# EAGLE design JOY_1_0 (EAGLE 8.3.2)
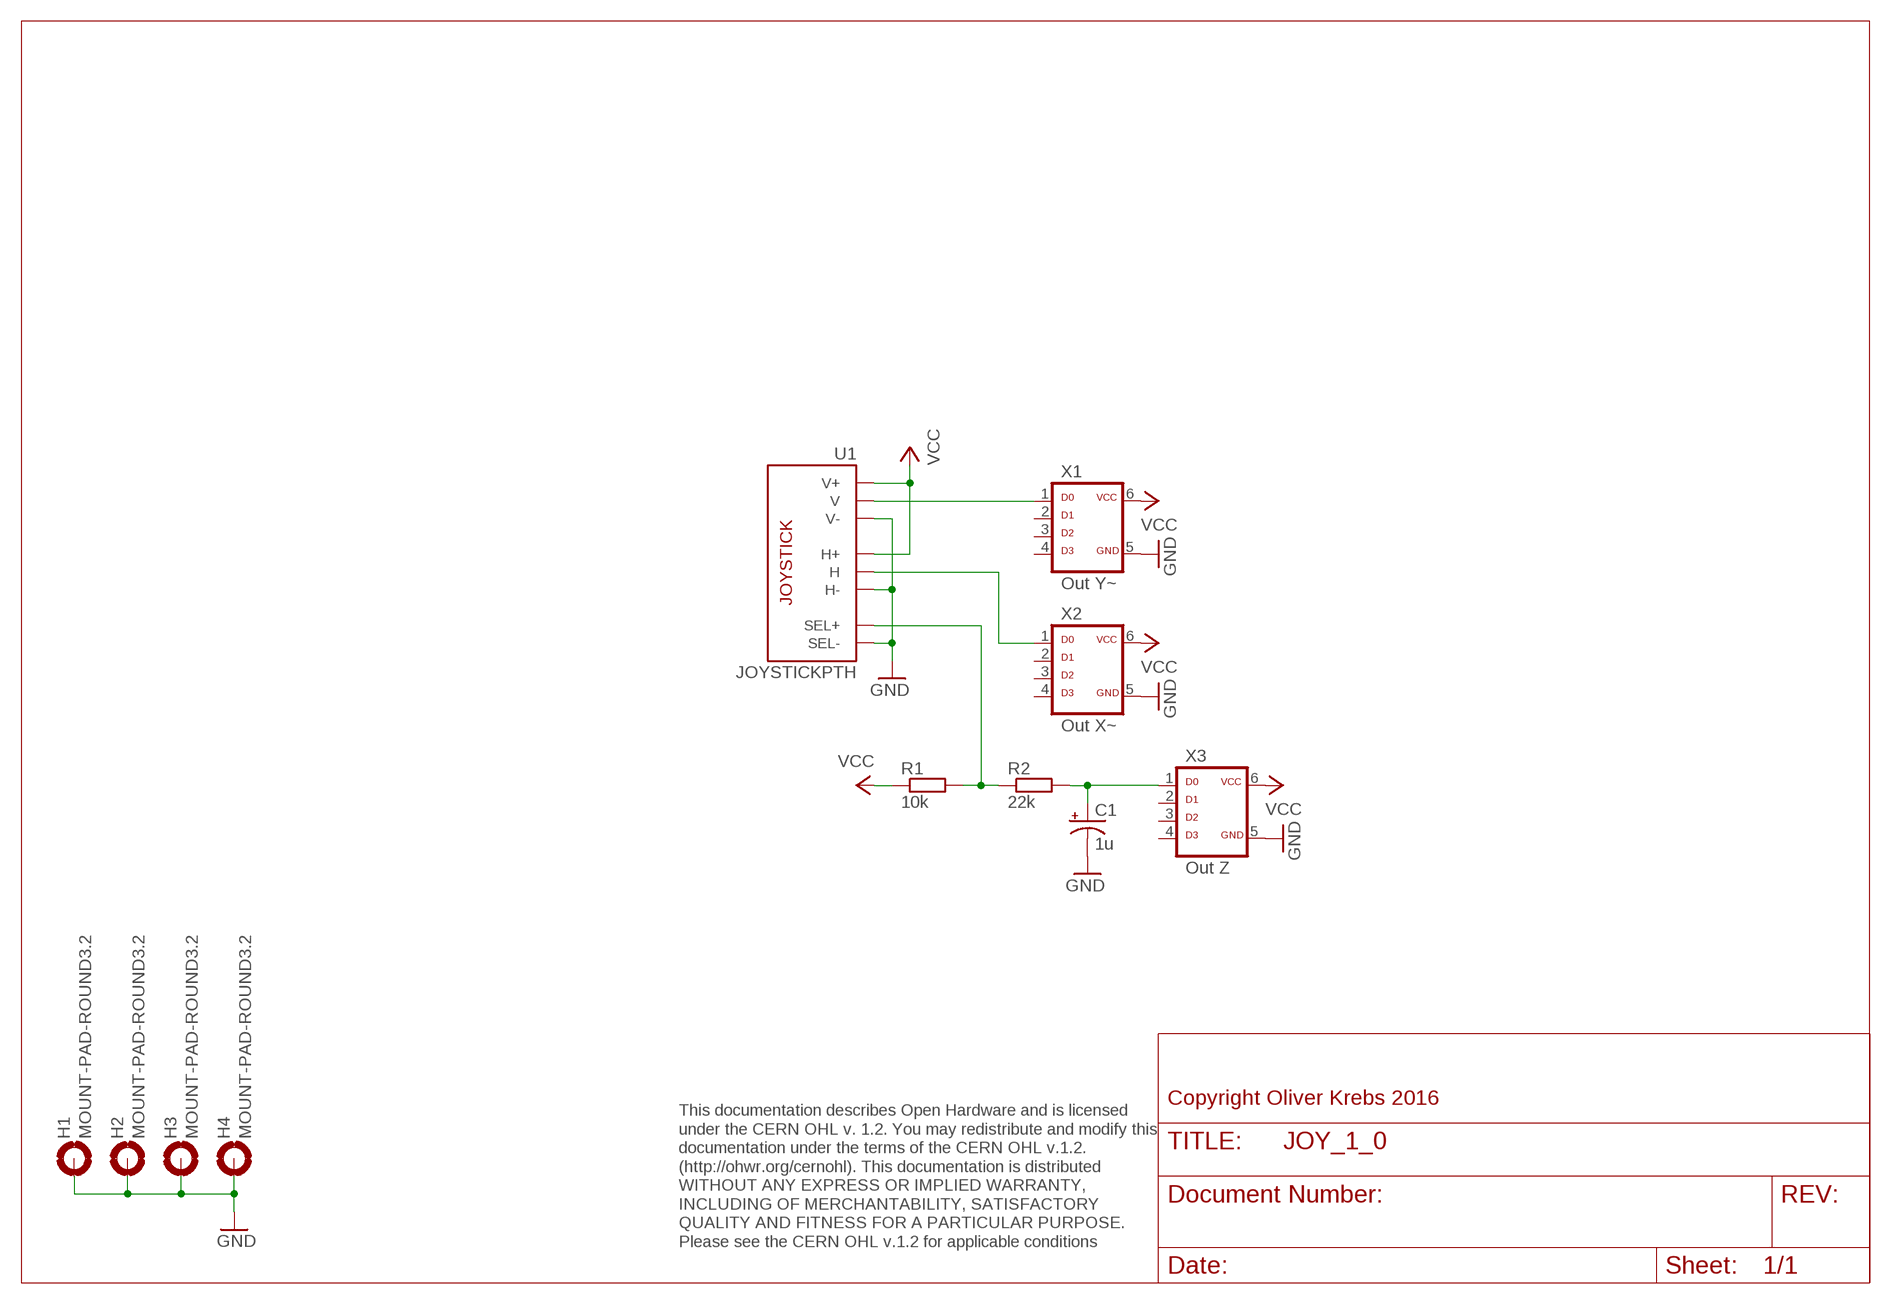
[diagram p0: schematic, sheet 1]

## Parts
C1  1u  CAP_POLPTH2  [CPOL-RADIAL-10UF-25V]
H1  MOUNT-PAD-ROUND3.2  [3,2-PAD]
H2  MOUNT-PAD-ROUND3.2  [3,2-PAD]
H3  MOUNT-PAD-ROUND3.2  [3,2-PAD]
H4  MOUNT-PAD-ROUND3.2  [3,2-PAD]
R1  10k  R-EU_0207/10  [0207/10]
R2  22k  R-EU_0207/10  [0207/10]
U1  JOYSTICKPTH  [JOYSTICK]
X1  Out Y~  ML6D  [ML-6]
X2  Out X~  ML6D  [ML-6]
X3  Out Z  ML6D  [ML-6]

## Nets
GND: C1.2(-) H1.B3,2(MOUNT) H2.B3,2(MOUNT) H3.B3,2(MOUNT) H4.B3,2(MOUNT) U1.B2A(SEL-) U1.H3(H-) U1.V3(V-) X1.5 X2.5 X3.5
N$1: U1.V2(V) X1.1
N$2: U1.H2(H) X2.1
N$3: R1.2 R2.1 U1.B1A(SEL+)
N$4: C1.1(+) R2.2 X3.1
VCC: R1.1 U1.H1(H+) U1.V1(V+) X1.6 X2.6 X3.6
Unconnected: X1.2 X1.3 X1.4 X2.2 X2.3 X2.4 X3.2 X3.3 X3.4

## Notes on the sheet
- Copyright Oliver Krebs 2016
- This documentation describes Open Hardware and is licensed 
  under the CERN OHL v. 1.2. You may redistribute and modify this 
  documentation under the terms of the CERN OHL v.1.2. 
  (http://ohwr.org/cernohl). This documentation is distributed
  WITHOUT ANY EXPRESS OR IMPLIED WARRANTY, 
  INCLUDING OF MERCHANTABILITY, SATISFACTORY 
  QUALITY AND FITNESS FOR A PARTICULAR PURPOSE. 
  Please see the CERN OHL v.1.2 for applicable conditions

## Library data of the parts
C1 = SparkFun-Passives:CAP_POL: Capacitor Polarized These are standard SMD and PTH capacitors. Normally 10uF, 47uF, and 100uF in electrolytic and tantalum varieties. Always verify the external diameter of the through hole cap, it varies with capacity, voltage, and manufacturer. The EIA devices should be standard.
H1-H4 = holes:MOUNT-PAD-ROUND: MOUNTING PAD, round
R1 R2 = 01-my_rcl:R-EU_: RESISTOR, European symbol
U1 = SparkFun-Electromechanical:JOYSTICK: Thumb Joystick Joystick commonly found in PS2 controllers. Two pots and a select switch. Footprint proven. Spark Fun Electronics SKU : COM-09032
X1-X3 = 01-my-con:ML6D

## Board
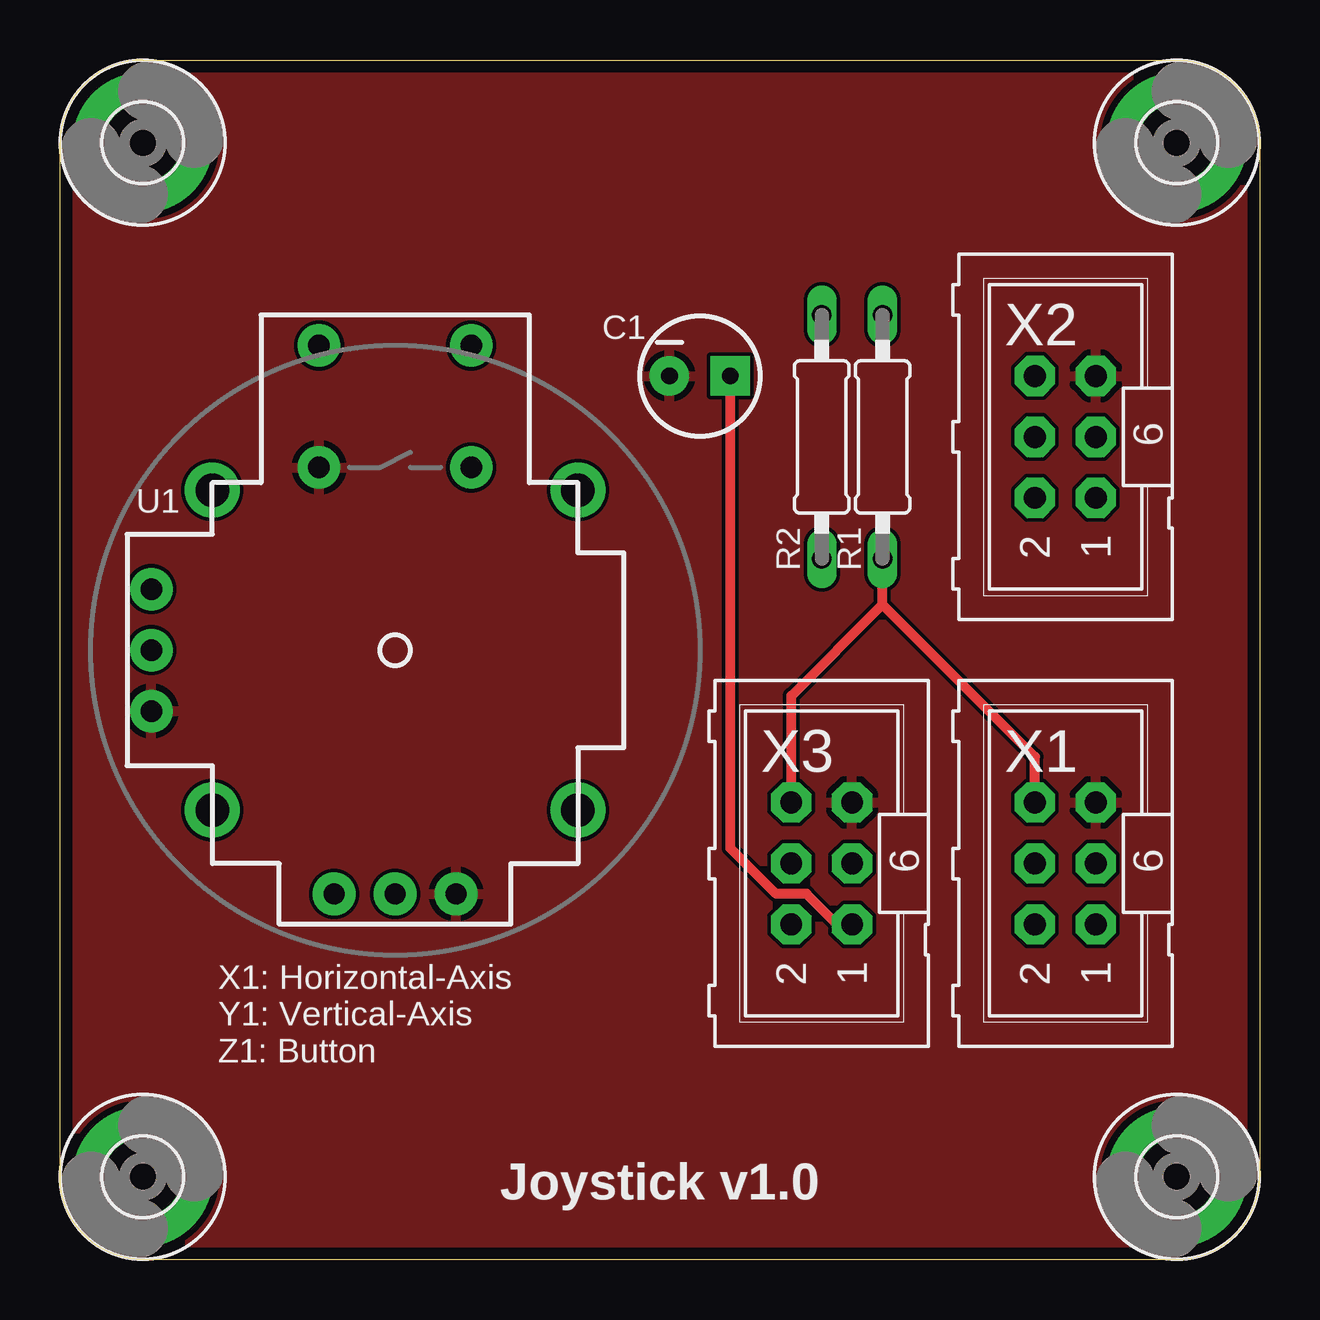
[diagram p1: board, top side]
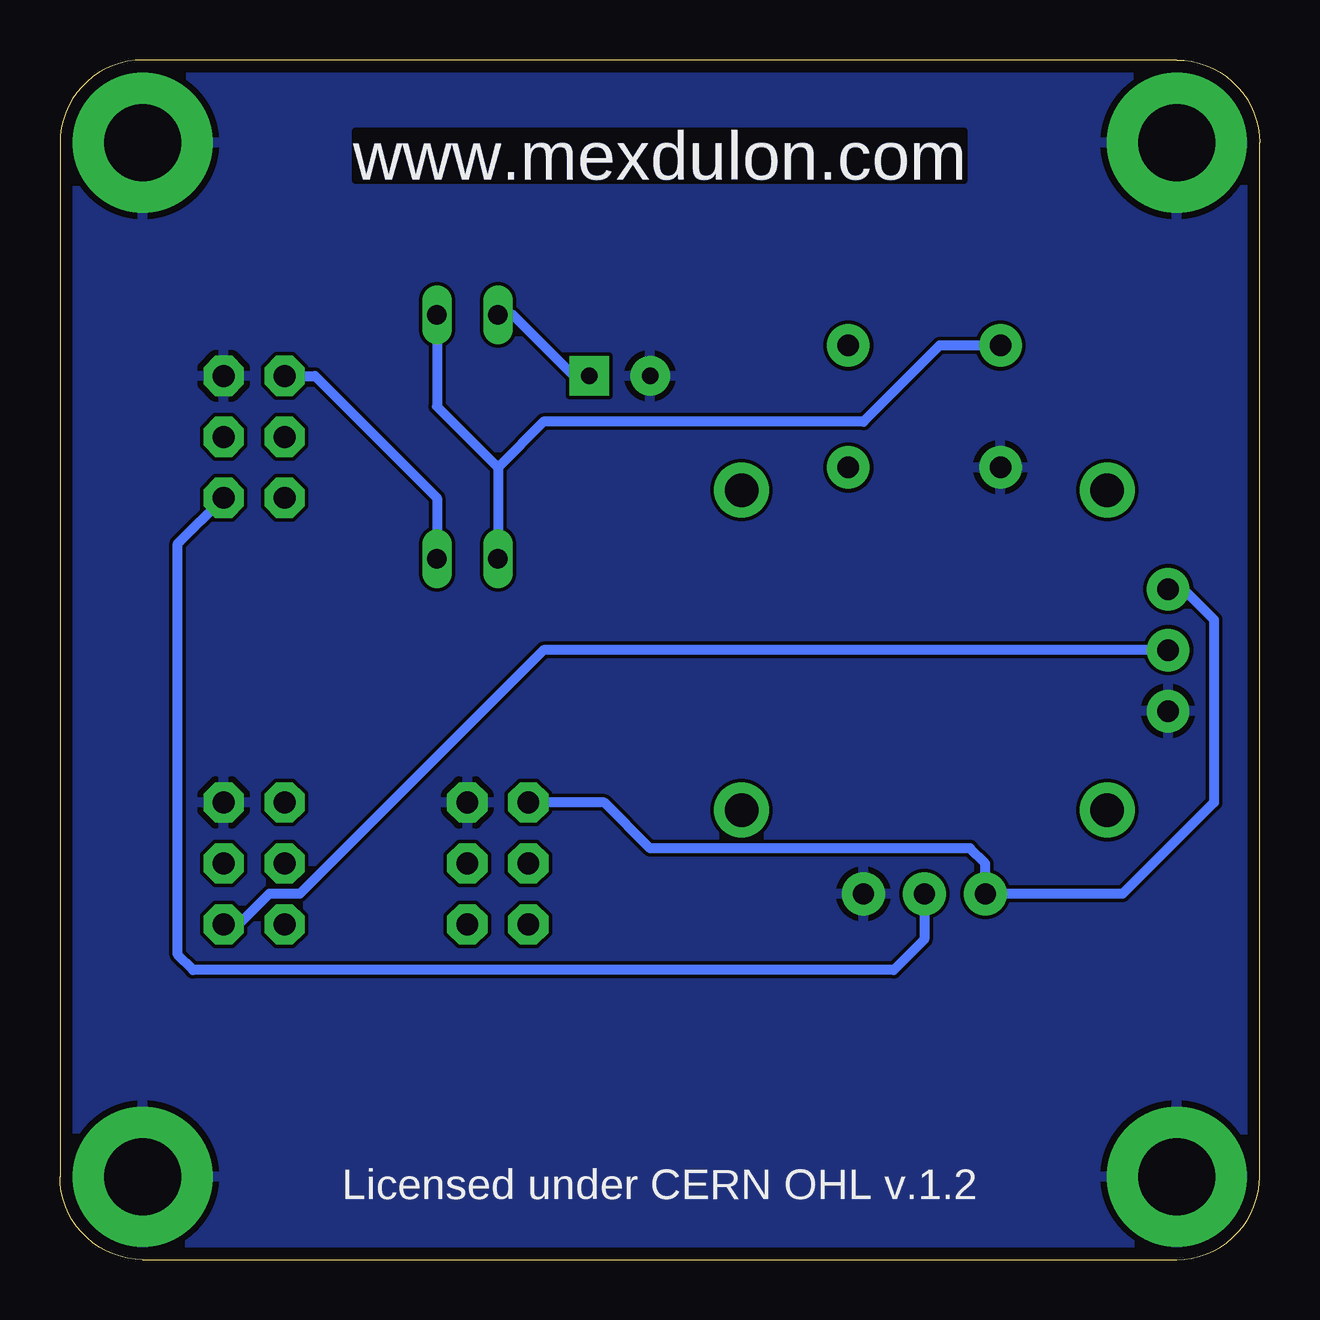
[diagram p2: board, bottom side, seen from below]

Size 50 x 50 mm. Coordinates in mm from the lower left corner, seen from the top.
Outline: 0,3.45 0,46.55 arc-90 3.45,50 46.55,50 arc-90 50,46.55 50,3.45 arc-90 46.55,0 3.45,0 arc-90 0,3.45
Copper layers (1*16): Top 0.035mm / dielectric 1.6mm / Bottom 0.035mm
Design rules "Elecrow_2-layer_PCB_eagle_rule": minimum track width 6mil, minimum drill 12mil, track to track 6mil, track to pad 6mil, pad to pad 6mil, via to via 8mil, smd to smd 0mil, copper to edge 20mil, drill to drill 10mil, minimum pad ring 6mil, minimum via ring 6mil, stop-mask expansion 0mil, vias tented up to drill 100mil, thermal gap 10mil

### Footprints (pad centres in the part's own frame; a part is rotated, then mirrored left to right if it is on the bottom)
CPOL-RADIAL-10UF-25V = drill 0.7 pad 1.651 square: 1 1.27,0 | drill 0.7 pad 1.651: 2 -1.27,0
3,2-PAD = drill 3.2 pad 5.842: B3,2 0,0
0207/10 = drill 0.813 long: 1 -5.08,0; 2 5.08,0
JOYSTICK = drill 0.9 pad 1.778: B1A -3.175,12.7; B1B 3.175,12.7; B2A -3.175,7.62; B2B 3.175,7.62 | drill 0.889 pad 1.778: H1 -2.54,-10.16; H2 0,-10.16; H3 2.54,-10.16; V1 -10.16,2.54; V2 -10.16,0; V3 -10.16,-2.54 | drill 1.397 pad 2.286: MOUNT1 -7.62,6.668; MOUNT2 -7.62,-6.668; MOUNT3 7.62,-6.668; MOUNT4 7.62,6.668
ML-6 = drill 0.914 pad 1.676 octagon: 1 -2.54,-1.27; 2 -2.54,1.27; 3 0,-1.27; 4 0,1.27; 5 2.54,-1.27; 6 2.54,1.27

### Placement (x,y rotation side)
C1  26.67,36.83 0 top
H1  3.45,3.45 0 top
H2  3.45,46.55 0 top
H3  46.55,3.45 0 top
H4  46.55,46.55 0 top
R1  34.29,34.29 90 top
R2  31.75,34.29 90 top
U1  13.97,25.4 0 top
X1  41.91,16.51 90 top
X2  41.91,34.29 90 top
X3  31.75,16.51 90 top

### Tracks (layer width: path | path; a pad name or v marks a point on that pad's centre or on a via)
GND
  pour Bottom: 0,0 50.8,0 50.8,50.8 0,50.8
  pour Top: 0,50.16 50.16,50.16 50.16,0 0,0
N$1
  Bottom 0.406: U1.V2 29.84,25.4 40.01,15.24 41.27,15.24 42.55,13.97 X1.1
N$2
  Bottom 0.406: U1.H2 13.97,13.34 15.24,12.06 44.45,12.06 45.09,12.7 45.09,29.84 X2.1
N$3
  Bottom 0.406: R1.2 34.29,35.56 31.75,33.02 | 31.75,33.02 R2.1 | U1.B1A 13.34,38.1 16.51,34.92 29.84,34.92 31.75,33.02
N$4
  Top 0.406: X3.1 32.38,13.97 31.11,15.24 29.84,15.24 27.94,17.14 C1.1
  Bottom 0.406: R2.2 31.11,39.37 28.57,36.83 C1.1
VCC
  Top 0.406: X3.6 30.48,23.5 34.29,27.3 | 34.29,27.3 R1.1 | X1.6 40.64,20.95 34.29,27.3
  Bottom 0.406: U1.V1 3.17,27.94 1.91,26.67 1.91,19.05 5.71,15.24 U1.H1 11.43,16.51 12.06,17.14 25.4,17.14 27.3,19.05 X3.6 | X2.6 39.37,36.83 34.29,31.75 R1.1

### Text on the board
Bottom: www.mexdulon.com
tNames: X1: Horizontal-Axis / Y1: Vertical-Axis / Z1: Button | Joystick v1.0
bNames: www.mexdulon.com | Licensed under CERN OHL v.1.2